# EasyEDA Pro project DOUBLE_CAMERA_SCARY.eprj, board Adafruit OV5640 Breakout
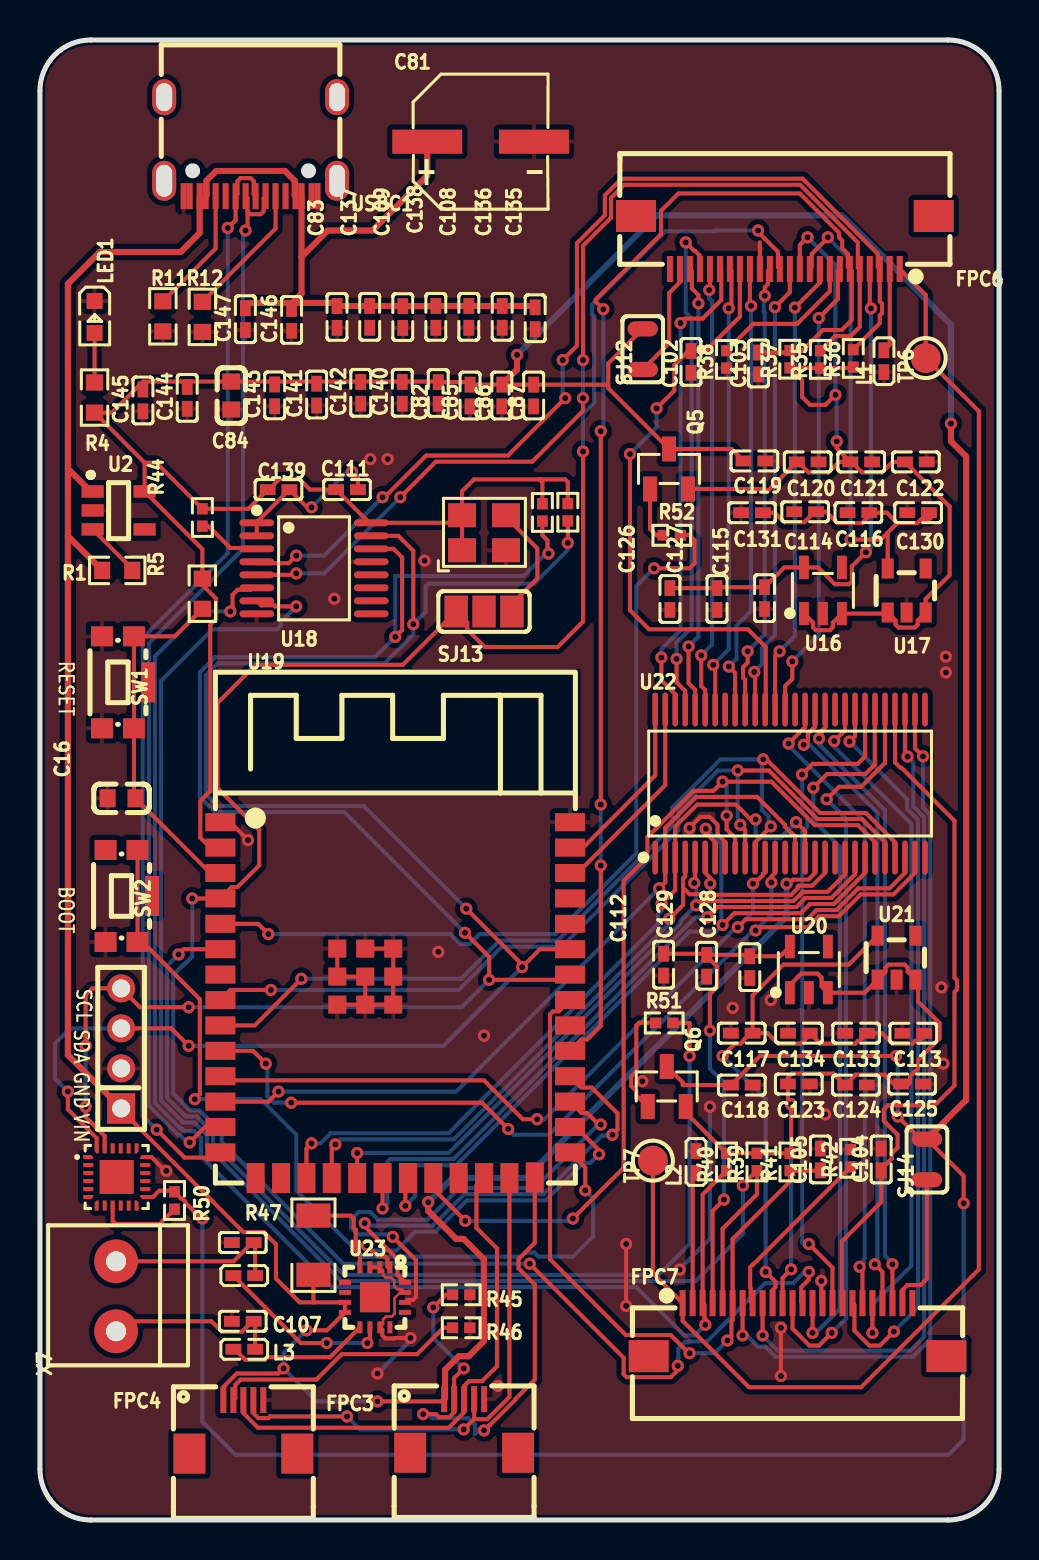
[diagram p1: board, top side]
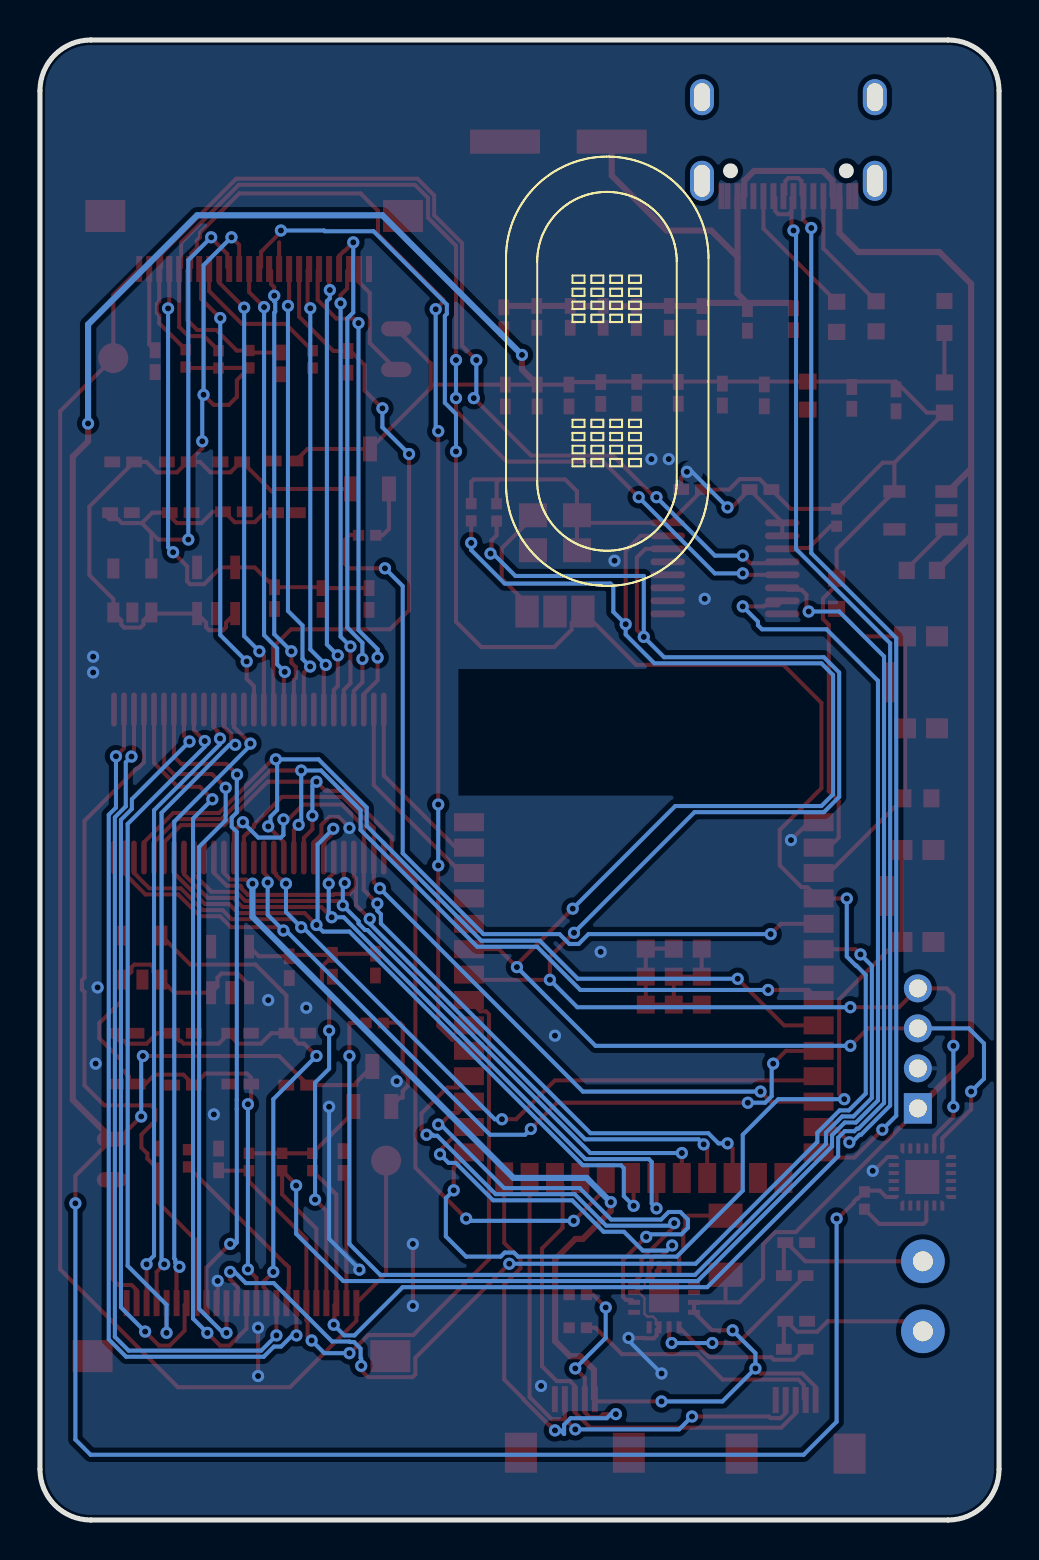
[diagram p2: board, bottom side, seen from below]

Outline 48 x 74 mm; copper layers: Top Layer, Bottom Layer. Coordinates in mm from the lower left corner of the outline.
Outline path: 0,71.46 0,2.54 arc(0.74,0.74) 2.54,0 45.46,0 arc(47.26,0.74) 48,2.54 48,71.46 arc(47.26,73.26) 45.46,74 2.54,74 arc(0.74,73.26) 0,71.46
Stack: Top Layer 0.035mm / Dielectric1 1.51mm FR4 er 4.5 / Bottom Layer 0.035mm

## Design rules (mm)
template: Custom Config
spacing copperThickness1oz (default): track to track 0.102, other pairs 0.152 to 0.3
spacing copperThickness2oz: track to track 0.203, other pairs 0.152 to 0.3
track width copperThickness1oz (default): min 0.127, default 0.254, max 2.54
track width copperThickness2oz: min 0.203, default 0.254, max 2.54
differential pair differentialPair (default): width min 0.127, default 0.254, max 2.54; gap min 0.152, default 0.152
via viaSize (default): diameter min 0.5, default 0.61, max 10; hole min 0.3, default 0.305, max 6.3

## Placement (name value [footprint] x y rotation side)
C16  1uF  [C0603]  4.08 36.08 180 top
C81  220uF  [CAP-SMD_BD6.3-L6.6-W6.6-LS7.2-FD]  22.05 68.92 0 top
C82  100nF  [C0402]  19.93 56.35 270 top
C83  100nF  [C0402]  14.87 60.15 270 top
C84  1uF  [C0603]  9.58 56.22 270 top
C85  100nF  [C0402]  21.52 56.22 270 top
C86  100nF  [C0402]  23.12 56.22 270 top
C87  100nF  [C0402]  24.71 56.22 270 top
C102  22pF  [C0402]  32.58 57.91 90 top
C103  100nF  [C0402]  35.96 57.83 270 top
C104  22pF  [C0402]  42.1 18.03 270 top
C105  100nF  [C0402]  39.06 18.03 90 top
C106  22pF  [C0402]  10.15 13.87 0 top
C107  22pF  [C0402]  10.15 9.94 0 top
C108  100nF  [C0402]  21.46 60.16 90 top
C109  10uF  [C0402]  18.16 60.15 90 top
C111  100nF  [C0402]  15.37 51.52 0 top
C112  100nF  [C0402]  31.21 27.77 90 top
C113  100nF  [C0402]  43.71 24.34 0 top
C114  100nF  [C0402]  38.3 50.41 0 top
C115  100nF  [C0402]  36.26 46.09 90 top
C116  100nF  [C0402]  40.96 50.37 0 top
C117  100nF  [C0402]  35.12 24.34 0 top
C118  100nF  [C0402]  35.12 21.75 180 top
C119  100nF  [C0402]  35.76 52.95 180 top
C120  10uF  [C0402]  38.42 52.91 180 top
C121  10uF  [C0402]  41.1 52.91 180 top
C122  10uF  [C0402]  43.84 52.91 180 top
C123  10uF  [C0402]  37.98 21.8 0 top
C124  10uF  [C0402]  40.84 21.75 180 top
C125  10uF  [C0402]  43.65 21.8 180 top
C126  10uF  [C0402]  31.53 46.05 90 top
C127  10uF  [C0402]  33.88 46.05 90 top
C128  10uF  [C0402]  35.52 27.64 90 top
C129  10uF  [C0402]  33.37 27.71 90 top
C130  10uF  [C0402]  43.95 50.37 0 top
C131  10uF  [C0402]  35.64 50.37 0 top
C133  10uF  [C0402]  40.85 24.34 0 top
C134  10uF  [C0402]  37.98 24.34 0 top
C135  100nF  [C0402]  24.78 60.09 270 top
C136  10uF  [C0402]  23.13 60.16 270 top
C137  10uF  [C0402]  16.5 60.16 270 top
C138  100nF  [C0402]  19.81 60.16 270 top
C139  100nF  [C0402]  11.94 51.52 0 top
C140  10uF  [C0402]  18.13 56.36 90 top
C141  10uF  [C0402]  13.85 56.27 90 top
C142  10uF  [C0402]  16.05 56.36 90 top
C143  10uF  [C0402]  11.75 56.23 90 top
C144  10uF  [C0402]  7.37 56.11 90 top
C145  10uF  [C0402]  5.15 55.98 90 top
C146  10uF  [C0402]  12.59 60 90 top
C147  10uF  [C0402]  10.28 60.04 90 top
FPC3  AFC01-S05FCA-00  [FPC-SMD_AFC01-S05FCA-00]  21.23 4.7 0 top
FPC4  AFC01-S05FCA-00  [FPC-SMD_AFC01-S05FCA-00]  10.18 4.66 0 top
FPC6  AFC01-S24FCA-00  [FPC-SMD_24P-P0.50_AFC01-S24FCA-00]  37.28 63.87 180 top
FPC7  AFC01-S24FCA-00  [FPC-SMD_24P-P0.50_AFC01-S24FCA-00]  37.92 9.52 0 top
JP1  HX PZ2.0-1x4P ZZ  [HDR-TH_4P-P2.00-V-M-3]  4.06 23.58 90 top
L1  BLM15AG102SN1D  [L0402]  42.24 57.94 90 top
L2  BLM15AG102SN1D  [L0402]  32.83 17.9 270 top
L3  BLM15AG102SN1D  [L0402]  10.22 8.53 0 top
L4  BLM15AG102SN1D  [L0402]  10.22 12.22 0 top
LED1  KT-0603G  [LED0603-RD]  2.73 60.15 270 top
Q5  HL3401A  [SOT-23-3_L2.9-W1.3-P1.90-LS2.4-BR]  31.48 52.55 270 top
Q6  HL3401A  [SOT-23-3_L2.9-W1.3-P1.90-LS2.4-BR]  31.37 21.68 270 top
R1  100kΩ  [R0603]  3.87 47.48 0 top
R4  10kΩ  [R0603]  2.73 56.12 270 top
R5  10kΩ  [R0603]  8.13 46.31 90 top
R11  5.1kΩ  [R0603]  6.15 60.18 90 top
R12  5.1kΩ  [R0603]  8.13 60.16 270 top
R35  10kΩ  [R0402]  39.06 58.03 90 top
R36  10kΩ  [R0402]  40.7 58.08 90 top
R37  10kΩ  [R0402]  37.53 58.04 90 top
R38  10kΩ  [R0402]  34.36 58.03 90 top
R39  10kΩ  [R0402]  35.88 17.9 270 top
R40  10kΩ  [R0402]  34.36 17.9 270 top
R41  10kΩ  [R0402]  37.53 17.9 270 top
R42  10kΩ  [R0402]  40.58 18.09 270 top
R44  10kΩ  [R0402]  8.13 50.12 270 top
R45  10kΩ  [R0402]  21.08 11.26 0 top
R46  10kΩ  [R0402]  21.08 9.61 0 top
R47  1mΩ  [R1206]  13.69 13.74 270 top
R48  47kΩ  [R0402]  26.42 50.39 90 top
R49  47kΩ  [R0402]  25.15 50.38 90 top
R50  47kΩ  [R0402]  6.73 15.97 90 top
R51  1kΩ  [R0402]  31.24 24.85 0 top
R52  1kΩ  [R0402]  31.62 49.24 0 top
SJ12  SOLDERJUMPER  [SOLDERJUMPER_ARROW_NOPASTE]  30.17 58.54 90 top
SJ13  SOLDERJUMPER_2WAY  [SOLDERJUMPER_2WAY_OPEN_NOPASTE]  22.23 45.43 0 top
SJ14  SOLDERJUMPER  [SOLDERJUMPER_ARROW_NOPASTE]  44.39 18.03 90 top
SW1  KMR221GLFS  [KEY-SMD_KMR2XXGXXX]  4.27 41.88 270 top
SW2  KMR221GLFS  [KEY-SMD_KMR2XXGXXX]  4.44 31.2 270 top
TP6  TESTPOINTROUND1.5MM  [TESTPOINT_ROUND_1.5MM]  44.33 58.1 0 top
TP7  TESTPOINTROUND1.5MM  [TESTPOINT_ROUND_1.5MM]  30.68 17.97 0 top
U2  AP2112K-3.3TRG1  [SOT-25-5_L2.9-W1.6-P0.95-LS2.8-BL]  3.94 50.48 270 top
U16  TLV74328PDBVR  [SOT-23-5_L3.0-W1.7-P0.95-LS2.8-BL]  39.18 46.48 0 top
U17  TLV74315PDBVR  [SOT-23-5_L2.9-W1.6-P0.95-LS2.8-BL]  43.38 46.48 0 top
U18  PCA9546APWR  [TSSOP-16_L5.0-W4.4-P0.65-LS6.4-BL]  13.72 47.58 270 top
U19  ESP32-S3-WROOM-1-N16R8  [WIRELM-SMD_ESP32-S3-WROOM-1]  17.78 25.99 0 top
U20  TLV74328PDBVR  [SOT-23-5_L3.0-W1.7-P0.95-LS2.8-BL]  38.48 27.52 0 top
U21  TLV74315PDBVR  [SOT-23-5_L2.9-W1.6-P0.95-LS2.8-BL]  42.87 28.12 0 top
U22  SN74CBT16211CDGGR  [TSSOP-56_L14.0-W6.1-P0.50-LS8.1-BL]  37.54 36.82 0 top
U23  MAX98357AETE+T  [TQFN-16_L3.0-W3.0-P0.50-BL-EP1.5]  16.76 11.14 180 top
U24  ICM-20948  [QFN-24_L3.0-W3.0-P0.40-BL-EP]  3.84 17.15 270 top
USBC1  TYPE-C-31-M-12  [USB-C_SMD-TYPE-C-31-M-12]  10.54 68.67 180 top
X7  TERMBLOCK_1X2  [TERMBLOCK_1X2-3.5MM]  3.81 11.14 90 top
X9  24MHz  [OSC-SMD_4P-L3.2-W2.5-BL]  22.23 49.36 0 top

## Footprints (pads in the part's own frame, mm; a bottom-side part is the same pattern mirrored in y, then rotated)
C0402
  rect 0.79x0.54 smd: 1(-0.545,0) 2(0.545,0)
C0603
  rect 0.8x0.9 smd: 1(-0.7,0) 2(0.7,0)
CAP-SMD_BD6.3-L6.6-W6.6-LS7.2-FD
  rect 3.5x1.2 smd: 1(-2.67,0) 2(2.67,0)
FPC-SMD_24P-P0.50_AFC01-S24FCA-00
  rect 0.3x1.3 smd: 1(-5.75,1.325) 2(-5.25,1.325) 3(-4.75,1.325) 4(-4.25,1.325) 5(-3.75,1.325) 6(-3.25,1.325) 7(-2.75,1.325) 8(-2.25,1.325) 9(-1.75,1.325) 10(-1.25,1.325) 11(-0.75,1.325) 12(-0.25,1.325) 13(0.25,1.325) 14(0.75,1.325) 15(1.25,1.325) 16(1.75,1.325) 17(2.25,1.325) 18(2.75,1.325) 19(3.25,1.325) 20(3.75,1.325) 21(4.25,1.325) 22(4.75,1.325) 23(5.25,1.325) 24(5.75,1.325)
  rect 2x1.6 smd: 25(7.449,-1.325) 26(-7.45,-1.325)
FPC-SMD_AFC01-S05FCA-00
  rect 0.3x1.3 smd: 1(-1,1.34) 2(-0.5,1.34) 3(0,1.34) 4(0.5,1.34) 5(1,1.34)
  rect 1.6x2 smd: 6(2.7,-1.34) 7(-2.7,-1.34)
HDR-TH_4P-P2.00-V-M-3
  rect 1.524x1.4 hole 0.9: 1(-3,0)
  round 1.4 hole 0.9: 2(-1,0) 3(1,0) 4(3,0)
KEY-SMD_KMR2XXGXXX
  rect 1x1.1 smd: 1(-2.3,0.438) 2(2.3,0.438) 3(-2.3,-1.162) 4(2.3,-1.162)
  rect 2x0.7 smd: 5(0,1.162)
L0402
  rect 0.79x0.54 smd: 1(-0.545,0) 2(0.545,0)
LED0603-RD
  rect 0.8x0.8 smd: 1(-0.799,0) 2(0.799,0)
OSC-SMD_4P-L3.2-W2.5-BL
  rect 1.4x1.2 smd: 1(-1.1,-0.875) 2(1.1,-0.875) 3(1.1,0.875) 4(-1.1,0.875)
QFN-24_L3.0-W3.0-P0.40-BL-EP
  custom 0.2x0.506 smd: 1(-1,-1.427) 6(1,-1.427) 13(1,1.427) 18(-1,1.427)
  rect 0.2x0.505 smd: 2(-0.6,-1.427) 3(-0.2,-1.427) 4(0.2,-1.427) 5(0.6,-1.427) 14(0.6,1.427) 15(0.2,1.427) 16(-0.2,1.427) 17(-0.6,1.427)
  custom 0.506x0.2 smd: 7(1.427,-1) 12(1.427,1) 19(-1.427,1) 24(-1.427,-1)
  rect 0.505x0.2 smd: 8(1.427,-0.6) 9(1.427,-0.2) 10(1.427,0.2) 11(1.427,0.6) 20(-1.427,0.6) 21(-1.427,0.2) 22(-1.427,-0.2) 23(-1.427,-0.6)
  rect 1.7x1.7 smd: 25(0,0)
R0402
  rect 0.566x0.54 smd: 1(-0.433,0) 2(0.433,0)
R0603
  rect 0.806x0.864 smd: 1(-0.753,0) 2(0.753,0)
R1206
  rect 1.208x1.701 smd: 1(-1.479,0) 2(1.479,0)
SOLDERJUMPER_2WAY_OPEN_NOPASTE
  rect 1.169x1.6 smd: 1(-1.397,0) 2(0,0) 3(1.397,0)
SOLDERJUMPER_ARROW_NOPASTE
  rrect 0.762x1.524 smd: 1(-1.016,0) 2(1.016,0)
SOT-23-3_L2.9-W1.3-P1.90-LS2.4-BR
  rect 1.25x0.7 smd: 1(1,-0.95) 2(1,0.95) 3(-1,0)
SOT-23-5_L2.9-W1.6-P0.95-LS2.8-BL
  rect 0.6x1 smd: 1(-0.95,-1.1) 2(0,-1.1) 3(0.95,-1.1) 4(0.95,1.1) 5(-0.95,1.1)
SOT-23-5_L3.0-W1.7-P0.95-LS2.8-BL
  rect 0.49x1.157 smd: 1(-0.95,-1.153) 2(0,-1.153) 3(0.95,-1.153)
  rect 0.49x1.175 smd: 4(0.95,1.153) 5(-0.95,1.153)
SOT-25-5_L2.9-W1.6-P0.95-LS2.8-BL
  rect 0.623x1.105 smd: 1(-0.95,-1.3) 2(-0.001,-1.3) 3(0.95,-1.3) 4(0.95,1.3) 5(-0.95,1.3)
TERMBLOCK_1X2-3.5MM
  round 2.184 hole 1: 1(1.8,0) 2(-1.7,0)
TESTPOINT_ROUND_1.5MM
  round 1.5 smd: P$1(0,0)
TQFN-16_L3.0-W3.0-P0.50-BL-EP1.5
  rect 0.25x0.6 smd: 1(-0.749,-1.5) 2(-0.248,-1.5) 3(0.252,-1.5) 4(0.751,-1.5) 9(0.75,1.5) 10(0.25,1.5) 11(-0.25,1.5) 12(-0.749,1.5)
  rect 0.6x0.25 smd: 5(1.5,-0.748) 6(1.5,-0.248) 7(1.5,0.252) 8(1.5,0.752) 13(-1.5,0.752) 14(-1.5,0.252) 15(-1.5,-0.248) 16(-1.5,-0.748)
  rect 1.5x1.5 smd: 17(0,0)
TSSOP-16_L5.0-W4.4-P0.65-LS6.4-BL
  oval 0.343x1.732 smd: 1(-2.275,-2.866) 2(-1.625,-2.866) 3(-0.975,-2.866) 4(-0.325,-2.866) 5(0.325,-2.866) 6(0.975,-2.866) 7(1.625,-2.866) 8(2.275,-2.866) 9(2.275,2.866) 10(1.625,2.866) 11(0.975,2.866) 12(0.325,2.866) 13(-0.325,2.866) 14(-0.975,2.866) 15(-1.625,2.866) 16(-2.275,2.866)
TSSOP-56_L14.0-W6.1-P0.50-LS8.1-BL
  oval 0.28x1.7 smd: 1(-6.75,-3.7) 2(-6.25,-3.7) 3(-5.75,-3.7) 4(-5.25,-3.7) 5(-4.75,-3.7) 6(-4.25,-3.7) 7(-3.75,-3.7) 8(-3.25,-3.7) 9(-2.75,-3.7) 10(-2.25,-3.7) 11(-1.75,-3.7) 12(-1.25,-3.7) 13(-0.75,-3.7) 14(-0.25,-3.7) 15(0.25,-3.7) 16(0.75,-3.7) 17(1.25,-3.7) 18(1.75,-3.7) 19(2.25,-3.7) 20(2.75,-3.7) 21(3.25,-3.7) 22(3.75,-3.7) 23(4.25,-3.7) 24(4.75,-3.7) 25(5.25,-3.7) 26(5.75,-3.7) 27(6.25,-3.7) 28(6.75,-3.7) 29(6.75,3.7) 30(6.25,3.7) 31(5.75,3.7) 32(5.25,3.7) 33(4.75,3.7) 34(4.25,3.7) 35(3.75,3.7) 36(3.25,3.7) 37(2.75,3.7) 38(2.25,3.7) 39(1.75,3.7) 40(1.25,3.7) 41(0.75,3.7) 42(0.25,3.7) 43(-0.25,3.7) 44(-0.75,3.7) 45(-1.25,3.7) 46(-1.75,3.7) 47(-2.25,3.7) 48(-2.75,3.7) 49(-3.25,3.7) 50(-3.75,3.7) 51(-4.25,3.7) 52(-4.75,3.7) 53(-5.25,3.7) 54(-5.75,3.7) 55(-6.25,3.7) 56(-6.75,3.7)
USB-C_SMD-TYPE-C-31-M-12
  oval 1.2x2 hole 0.8x1.6: 0(-4.325,1.706) 1(4.325,1.706)
  oval 1.2x1.8 hole 0.8x1.4: 2(4.325,-2.474) 3(-4.325,-2.474)
  rect 0.3x1.3 smd: A1(-3.35,2.474) A4(-2.55,2.474) A5(-1.25,2.474) A6(-0.25,2.474) A7(0.25,2.474) A8(1.25,2.474) A9(2.55,2.474) A12(3.35,2.474) B1(3.05,2.474) B4(2.25,2.474) B5(1.75,2.474) B6(0.75,2.474) B7(-0.75,2.474) B8(-1.75,2.474) B9(-2.25,2.474) B12(-3.05,2.474)
WIRELM-SMD_ESP32-S3-WROOM-1
  rect 1.5x0.9 smd: 1(-8.75,8.895) 2(-8.75,7.625) 3(-8.75,6.355) 4(-8.75,5.085) 5(-8.75,3.815) 6(-8.75,2.545) 7(-8.75,1.275) 8(-8.75,0.005) 9(-8.75,-1.265) 10(-8.75,-2.535) 11(-8.75,-3.805) 12(-8.75,-5.075) 13(-8.75,-6.345) 14(-8.75,-7.615) 27(8.75,-7.615) 28(8.75,-6.345) 29(8.75,-5.075) 30(8.75,-3.805) 31(8.75,-2.535) 32(8.75,-1.265) 33(8.75,0.005) 34(8.75,1.275) 35(8.75,2.545) 36(8.75,3.815) 37(8.75,5.085) 38(8.75,6.355) 39(8.75,7.625) 40(8.75,8.895)
  rect 0.9x1.5 smd: 15(-6.985,-8.895) 16(-5.715,-8.895) 17(-4.445,-8.895) 18(-3.175,-8.895) 19(-1.905,-8.895) 20(-0.635,-8.895) 21(0.635,-8.895) 22(1.905,-8.895) 23(3.175,-8.895) 24(4.445,-8.895) 25(5.715,-8.895) 26(6.985,-8.865)
  rect 0.9x0.9 smd: 41(-2.9,2.575) 41(-2.9,1.175) 41(-2.9,-0.225) 41(-1.5,2.575) 41(-1.5,1.175) 41(-1.5,-0.225) 41(-0.1,2.575) 41(-0.1,1.175) 41(-0.1,-0.225)

## Nets
As in the schematic, except:
GND: C16.2 C81.2 C82.2 C83.2 C84.2 C85.2 C86.2 C87.2 C102.1 C103.2 C104.1 C105.2 C106.1 C107.1 C108.1 C109.1 C112.1 C113.1 C114.1 C115.1 C116.1 C117.1 C118.1 C119.1 C120.1 C121.1 C122.1 C123.2 C124.1 C125.1 C126.1 C127.1 C128.1 C129.1 C130.1 C131.1 C133.1 C134.1 C135.2 C136.2 C138.2 C140.1 C141.1 C142.1 C143.1 C144.1 C145.1 C146.1 C147.1 FPC3.5 FPC4.5 FPC6.15 FPC7.15 JP1.2 L1.1 L2.1 LED1.1 R11.1 R12.2 R38.1 R42.1 R45.2 R46.2 SW1.3 SW1.4 SW2.4 U2.2 U16.2 U17.2 U18.8 U18.13 U19.1 U19.40 U19.41 U20.2 U21.2 U22.8 U23.2 U23.3 U23.11 U23.15 U24.18 USBC1.A1 USBC1.A12 USBC1.B1 USBC1.B12 X9.2
$2N4099: C111.2 C139.2 U18.1 U18.2

Pads without a net: C137 2; FPC3 6 7; FPC4 6 7; FPC6 25 26; FPC7 25 26; SJ13 2; SW1 5; SW2 3 5; U2 4; U16 4; U17 4; U18 9 10 11 12; U19 7 15 16 23 32 36 37; U20 4; U21 4; U22 1 14 28 29 38 42 49; U23 5 6 12 13 17; U24 1 2 3 4 5 6 7 8 10 11 12 14 15 16 17 19 20 21 22 25; USBC1 0 1 2 3 A8 B8

## Via types
v1: diameter 0.61, hole 0.305, Top Layer to Bottom Layer, 191 vias

## Routing (per net, layer and track width the routed paths; a pad name or vN(x,y) marks a point on that pad's centre or on a via; arc(x,y) is an arc through that point)
1.5V: length 34.9
  Top Layer w0.203: v1(34.16,23.2) 34.78,23.82 35.08,23.82 35.23,23.97 35.23,24.01 35.56,24.34 C117.2 ; C117.2 35.67,26.23 35.89,26.45 35.9,26.45 36.05,26.6 36.05,26.61 37.21,27.77 40.48,27.77 U21.5 ; C117.2 36.42,24.34 36.94,23.82 38.08,23.82 38.53,24.26 C134.2 39.05,23.82 40.8,23.82 40.95,23.96 41.02,23.96 41.39,24.33 C133.2 42.14,24.34 42.67,23.81 43.66,23.81 43.81,23.96 ; C113.2 44.25,24.2 44.02,23.96 43.81,23.96 ; FPC7.10 36.66,11.5 36.81,11.65 36.81,11.92 v1(36.32,12.41)
  Bottom Layer w0.203: v1(34.16,23.2) 36.32,21.04 v1(36.32,12.41)
1.5V_X: length 32
  Top Layer w0.203: C130.2 44.51,50.37 44.61,50.27 44.61,50.13 44.51,50.04 44.1,50.04 43.9,49.84 42.9,49.84 ; v1(40.57,49.02) 42.08,49.02 42.43,49.37 ; 42.9,49.84 42.43,49.37 ; 42.9,49.84 42.38,50.37 C116.2 41.5,50.21 41.14,49.84 39.91,49.84 39.35,50.41 C114.2 38.79,50.37 38.73,50.37 38.25,49.89 37.25,49.89 36.77,50.37 C131.2 ; 42.43,49.37 U17.5 ; v1(39.43,64.14) 39.43,64.11 38.63,63.3 38.63,62.65 FPC6.10
  Bottom Layer w0.203: v1(39.43,64.14) 40.57,62.99 v1(40.57,49.02)
2.8V: length 24.9
  Top Layer w0.203: C129.2 33.31,28.31 C112.2 ; C129.2 33.4,28.22 33.4,28.16 33.89,27.67 33.89,26.67 33.53,26.31 v1(33.53,24.47) ; C129.2 35.46,28.26 C128.2 37.05,28.19 U20.5 ; v1(34.23,16.02) 33.67,15.45 FPC7.4
  Bottom Layer w0.203: v1(33.53,24.47) 33.53,22.57 34.23,21.86 v1(34.23,16.02)
2.8V_X: length 26
  Top Layer w0.203: v1(41.34,48.39) 40.63,47.68 40.63,46.94 40.48,46.79 39.78,46.79 38.94,47.63 U16.5 37.25,47.63 C115.2 33.93,46.64 C127.2 C126.2 ; v1(41.59,60.58) 41.53,60.64 FPC6.4
  Bottom Layer w0.203: v1(41.34,48.39) 41.59,48.64 v1(41.59,60.58)
3.3V: length 12.9
  Top Layer w0.203: FPC4.2 9.78,6.09 9.78,6.75 10.04,7.02 13.83,7.02 15.1,8.29 18.87,8.29 20.19,9.61 R46.1
3V3: length 249.8
  Top Layer w0.203: SJ12.2 28.44,57.83 28.44,56.68 ; v1(42.85,23.2) 36.03,23.2 C118.2 32.17,21.75 32.17,21.87 Q6.3 ; 28.44,56.68 28.44,56.59 Q5.3 34.61,53.55 C119.2 ; 28.44,56.68 28.36,56.77 C87.1 C86.1 C85.1 21.4,56.9 C82.1 19.9,56.92 C84.1 5.16,56.92 3.61,55.37 R4.2 5.24,52.87 ; 5.24,52.87 5.24,51.43 8.13,48.54 R5.2 8.13,46.75 8.81,46.07 8.81,45.05 8.52,44.76 8.52,36.45 8.03,35.95 8.03,34.11 8.52,33.62 U19.2 ; 5.24,52.87 5.82,52.87 R44.1 10.43,50.56 C139.1 11.46,51.52 11.98,52.04 12.98,52.04 13.51,51.52 C111.1 16.48,49.86 U18.16 20.75,49.86 X9.4 ; R49.2 25.15,51.89 25,52.03 ; U24.13 5.65,16.15 5.97,16.47 6.67,16.47 R50.2 7.06,16.08 7.11,16.08 7.26,15.93 7.26,15.88 8.07,15.07 v1(8.13,15.07) ; 25,52.03 21.72,52.03 21.12,51.44 X9.4 ; 25,52.03 26.29,52.03 26.42,51.9 26.42,50.82 R48.2 ; X9.4 X9.1 ; v1(42.93,20.17) 44.06,19.04 SJ14.2 46.23,17.21 v1(46.23,15.83)
  Top Layer w0.305: C86.1 23.88,57.53 v1(23.88,58.25) ; v1(45.59,54.82) 45.59,53.93 46.36,53.17 46.36,21.01 SJ14.2
  Bottom Layer w0.203: v1(42.85,23.2) 42.93,23.12 v1(42.93,20.17) ; v1(8.13,15.07) 8.13,4.91 9.78,3.26 45.47,3.26 46.23,4.02 v1(46.23,15.83)
  Bottom Layer w0.305: v1(45.59,54.82) 45.59,59.78 40.13,65.24 30.86,65.24 v1(23.88,58.25)
AGND: length 6.6
  Top Layer w0.203: FPC7.2 32.67,17.19 L2.2
AGND_X: length 4.2
  Top Layer w0.203: L1.2 42.53,58.78 FPC6.2
GND: length 44.3
  Top Layer w0.127: U23.2 17.17,12.48 17.17,12.25 17.3,12.12 17.58,12.12 17.73,11.97 17.73,11.69 17.87,11.54 18.1,11.54 U23.15 18.03,11.38 17.75,11.1 17.75,10.31 17.6,10.17 17.32,10.17 17.17,10.02 17.17,9.79 U23.11
  Top Layer w0.203: U19.41 U19.41 U19.41 U19.41 U19.41 ; U19.1 9.52,34.89 v1(10.41,34) ; FPC7.15 39.11,10.9 v1(39.11,11.95) ; v1(29.34,13.8) v1(29.34,10.7) ; v1(18.54,9.1) 17.76,9.1 17.74,9.08 17.28,9.08 17.13,9.23 17.13,9.52 U23.11 ; U22.8 34.29,33.89 33.91,34.27 33.91,34.76 33.52,35.15 33.05,35.15 32.53,34.63 32.51,34.63 ; U23.3 U23.2 ; 36.03,62.55 36.03,63.88 ; U19.41 U19.41 ; U19.41 U19.41 U19.41 U19.41 ; v1(6.32,17.46) 6.27,17.46 5.58,18.15 U24.18 ; v1(37.08,7.2) v1(37.08,9.61)
  Bottom Layer w0.203: v1(18.54,9.1) 18.54,8.98 v1(16.89,7.33) ; v1(33.53,20.66) 33.53,14.06 32,12.53 ; 6.22,17.49 6.25,17.46 v1(6.32,17.46)
  vias: v1(14.73,46.06) v1(16.53,53.05) v1(17.4,53.05) v1(19.24,47.97) v1(19.94,28.41) v1(22.23,24.22) v1(22.92,6.7) v1(30.15,21.94) v1(32.02,12.52) v1(32.51,34.6) v1(34.67,25.61) v1(36.58,25.99) v1(39.3,20.28) v1(45.11,26.63) v1(45.21,22.82) v1(45.34,43.17) v1(45.34,42.38)
VCC: length 168
  Top Layer w0.203: 13.67,10.88 13.69,10.9 R47.2 ; 13.67,10.88 U23.7 U23.8 14.36,9.48 v1(13.33,9.48) ; 13.67,10.88 13,10.88 11.81,12.07 11.81,13.78 11.2,14.4 10.17,14.4 4.06,20.51 JP1.1 ; FPC3.1 20.11,5.93 v1(16.89,5.93) ; 38.79,33.12 38.79,32.36 38.46,32.02 37.69,32.02 37.49,31.82 v1(37.36,31.82) ; FPC4.1 9.18,6.66 9.85,7.33 11.94,7.33 v1(12.19,7.58)
  Top Layer w0.305: USBC1.A4 13.09,63.16 ; 13.09,63.16 13.09,61.32 12.62,60.85 ; 13.09,63.16 14.4,64.48 16.64,64.48 19.38,67.22 C81.1 ; 12.62,60.85 14.71,60.85 C83.1 16.5,60.7 C137.1 18.15,60.7 C109.2 19.8,60.69 C138.1 C108.2 C136.1 24.72,60.7 C135.1 ; 12.62,60.85 10.43,60.85 ; JP1.1 1.4,23.25 1.4,49.2 ; USBC1.A9 7.99,64.35 7.04,63.4 2.99,63.4 1.4,61.81 1.4,52.57 ; 1.4,49.2 R1.1 ; 1.4,49.2 1.4,52.57 ; 1.4,52.57 2.64,51.33 ; FPC3.1 20.27,6.09 20.27,7.51 20.96,8.19 21.46,8.19 22.22,8.94 22.22,13.04 21.2,14.06 20.83,14.06 19.43,15.45 v1(19.43,15.89) ; USBC1.B4 8.34,66.24 8.34,66.97 8.82,67.45 12.26,67.45 12.75,66.97 12.75,66.24 USBC1.B9
  Bottom Layer w0.203: v1(16.89,5.93) 13.84,5.93 v1(12.19,7.58) 12.19,8.34 v1(13.33,9.48)
  Bottom Layer w0.305: v1(37.36,31.82) 37.36,30.16 24.3,17.1 20.64,17.1 v1(19.43,15.89)
VINA: length 50.1
  Top Layer w0.203: C121.2 39.88,53.58 v1(39.88,53.93) ; C121.2 39.99,52.91 39.47,52.38 38.47,52.38 37.95,52.91 C120.2 36.4,51.43 36.27,51.55 Q5.2 ; C121.2 40.62,52.91 41.15,52.38 42.15,52.38 42.67,52.91 43.29,52.91 45.53,50.67 45.53,47.24 44.33,46.04 U17.3 43.93,44.98 43.93,44.77 43.78,44.62 42.97,44.62 42.82,44.77 42.82,44.98 U17.1 42.37,45.32 U16.3 39.68,44.87 39.68,44.64 39.53,44.49 38.83,44.49 38.69,44.64 38.69,44.87 U16.1 ; 38.03,62.55 38.03,63.75 v1(38.42,64.14) ; R36.1 40.66,57.6 R35.1 39.05,57.61 R37.1 38.14,56.99 38.14,56.15 38.54,55.75 39.3,55.75 v1(39.81,56.26)
  Bottom Layer w0.203: v1(38.42,64.14) 39.81,62.74 v1(39.81,56.26) 39.88,56.2 v1(39.88,53.93)
VINB: length 42.3
  Top Layer w0.203: U20.1 37.53,26.75 37.93,27.14 37.93,27.15 38.1,27.32 38.91,27.32 39.12,27.12 39.12,26.68 U20.3 41.27,26.36 U21.1 42.32,27.41 42.32,27.62 42.47,27.77 43.28,27.77 43.43,27.62 43.43,27.41 U21.3 43.95,26.89 43.95,25.92 45.03,24.84 45.03,24.09 43.95,23.01 43.95,22.58 43.54,22.17 43.54,21.86 43.48,21.8 C125.2 42.74,21.8 42.27,22.27 40.82,22.27 C124.2 39.72,22.32 37.64,22.32 37.43,22.11 C123.1 37.43,20.95 v1(37.59,20.79) 37.59,18.39 R41.1 R39.1 R40.1 32.19,20.5 32.32,20.63 Q6.2 ; FPC7.11 37.17,12.11 v1(37.59,12.53)
  Bottom Layer w0.203: v1(37.59,12.53) v1(37.59,20.79)
BCLK: length 22.4
  Top Layer w0.203: U19.30 27.1,21.62 27.61,21.62 28.9,20.33 28.9,19.52 v1(28.65,19.26) ; U23.16 17.89,12.26 17.89,13.04 16.26,14.67 v1(16.26,14.84)
  Bottom Layer w0.203: v1(16.26,14.84) 16.38,14.72 19.66,14.72 21.24,16.29 25.19,16.29 28.12,19.21 28.3,19.21 28.35,19.26 v1(28.65,19.26)
BOOT: length 44.1
  Top Layer w0.203: v1(27.29,16.48) 27.29,17.62 U19.27 ; v1(7.75,21.04) 8,21.3 8,26.04 5.14,28.9 SW2.2 SW2.1
  Bottom Layer w0.203: v1(7.75,21.04) 11.05,21.04 12.83,19.26 12.83,16.47 16.13,13.17 24.08,13.17 24.28,13.37 24.74,13.37 24.95,13.17 26.67,13.17 27.69,14.18 27.69,16.09 v1(27.29,16.48)
D2: length 38.6
  Top Layer w0.203: v1(11.94,21.42) 11.43,20.92 U19.12 ; v1(30.99,31.58) 31.29,31.89 U22.2 31.29,34.61 32.84,36.15 35.89,36.15 37.29,34.76 37.29,34.66 37.61,34.33 37.64,34.33 37.79,34.17 37.79,33.12
  Bottom Layer w0.203: v1(11.94,21.42) 20.83,21.42 v1(30.99,31.58)
D3: length 38.9
  Top Layer w0.203: U19.17 13.33,18.58 v1(13.59,18.83) ; v1(31.11,30.82) 31.79,31.5 31.79,34.67 32.89,35.77 34.83,35.77 35.57,35.03 v1(35.81,35.03) ; U22.16 38.29,34.44 v1(37.84,34.89)
  Bottom Layer w0.203: v1(13.59,18.83) 14.04,18.83 14.55,19.34 20.45,19.34 30.94,29.83 30.94,30.29 31.11,30.47 v1(31.11,30.82) ; v1(35.81,35.03) 35.81,34.25 35.94,34.12 37.08,34.12 v1(37.84,34.89)
D4: length 35.2
  Top Layer w0.203: 32.19,31.62 32.19,32.08 32.29,32.19 U22.4 ; 32.19,31.62 32.51,31.29 33.28,31.29 33.32,31.26 37.6,31.26 37.92,31.59 37.92,31.67 37.97,31.71 38.65,31.71 39.29,32.36 U22.18 ; 32.19,31.62 32.19,30.75 v1(31.5,30.06) ; v1(14.78,18.78) 14.61,18.6 U19.18
  Bottom Layer w0.203: v1(14.78,18.78) 15.04,19.04 20.71,19.04 31.5,29.82 v1(31.5,30.06)
D5: length 34.8
  Top Layer w0.203: 32.79,33.12 32.79,31.9 v1(32.75,31.85) ; v1(15.87,18.35) U19.19 ; v1(32.84,30.73) 33.06,30.95 37.72,30.95 38.18,31.41 39.42,31.41 40.29,32.29 U22.20
  Bottom Layer w0.203: v1(15.87,18.35) 20.46,18.35 31.61,29.5 31.73,29.5 32.05,29.83 32.05,29.94 v1(32.84,30.73) 32.84,31.67 32.75,31.77 v1(32.75,31.85)
D6: length 37.3
  Top Layer w0.203: v1(33.4,30.14) 33.91,30.65 37.86,30.65 38.31,31.1 39.61,31.1 40.79,32.29 40.79,33.12 ; v1(17.14,15.58) U19.20 ; v1(33.55,31.82) 33.55,32.1 33.29,32.36 U22.6
  Bottom Layer w0.203: v1(33.55,31.82) 33.55,30.28 v1(33.4,30.14) 32.8,30.14 20.7,18.04 17.53,18.04 17.38,17.9 17.38,15.82 v1(17.14,15.58)
D7: length 39.7
  Top Layer w0.203: v1(18.29,15.71) 18.29,16.97 U19.21 ; U22.22 41.29,32.36 39.74,30.8 38.53,30.8 38.08,30.34 34.75,30.34 v1(34.16,29.75) ; 33.79,33.12 33.79,33.89 33.32,34.36 v1(33.32,34.56)
  Bottom Layer w0.203: v1(18.29,15.71) 18.78,16.2 18.78,17.6 18.92,17.74 20.83,17.74 32.51,29.42 33.83,29.42 v1(34.16,29.75) 34.11,29.81 34.11,33.78 v1(33.32,34.56)
D8: length 47.5
  Top Layer w0.203: v1(21.29,14.96) 19.68,16.56 U19.22 ; 34.79,33.12 34.79,34.1 34.37,34.53 v1(34.37,35.21) ; 41.79,33.12 41.79,33.89 40.94,34.74 38.78,34.74 36.61,36.92 v1(34.16,36.92) 33.71,36.46 32.72,36.46 30.4,34.14 30.4,33.15 29.21,31.96 29.21,17.61 v1(26.67,15.07)
  Bottom Layer w0.203: v1(34.37,35.21) 34.37,36.71 v1(34.16,36.92) ; v1(21.29,14.96) 26.56,14.96 v1(26.67,15.07)
D9: length 45.4
  Top Layer w0.203: U19.8 9.53,26.5 v1(11.56,26.5) ; v1(35.05,34.76) 35.29,34.52 U22.10 ; v1(34.92,37.47) 36.48,37.47 38.91,35.05 41.14,35.05 42.29,33.89 U22.24
  Bottom Layer w0.203: v1(11.56,26.5) 20.95,26.5 23.11,28.66 26.11,28.66 31.95,34.5 31.95,35.5 33.93,37.47 v1(34.92,37.47) 34.92,34.88 v1(35.05,34.76)
D+: length 55.3
  Top Layer w0.203: v1(9.4,64.6) 9.79,65 USBC1.B6 9.89,66.29 9.89,66.95 10.04,67.1 10.55,67.1 10.69,66.95 10.69,66.29 USBC1.A6 ; v1(5.84,19.52) 7.24,18.12 8.77,18.12 U19.14
  Bottom Layer w0.203: v1(9.4,64.6) 9.4,48.35 5.14,44.09 5.14,20.21 v1(5.84,19.52)
D-: length 53.9
  Top Layer w0.203: U19.13 8.26,19.65 v1(7.49,18.88) ; USBC1.B7 11.19,66.1 11.19,65.44 11.05,65.29 10.54,65.29 10.39,65.44 ; v1(10.29,64.48) 10.39,64.58 10.39,65.44 ; USBC1.A7 10.39,66.1 10.39,65.44
  Bottom Layer w0.203: v1(7.49,18.88) 7.37,18.88 6.98,19.26 6.91,19.26 5.45,20.72 5.45,43.84 10.16,48.55 10.16,64.22 10.29,64.35 v1(10.29,64.48)
DATA1: length 7.1
  Top Layer w0.203: SJ14.1 44.39,12.07 44.07,11.75 43.41,11.75 43.17,11.5 FPC7.23
DATA1_X: length 5.8
  Top Layer w0.203: 32.03,62.55 32.07,62.51 32.07,61.93 31.49,61.36 31.49,58.85 SJ12.1
DATA2: length 31.8
  Top Layer w0.203: 37.47,38.82 38.29,39.65 U22.41 ; FPC7.19 41.17,12.52 v1(41.02,12.66)
  Bottom Layer w0.203: v1(41.02,12.66) 41.22,12.86 41.22,13.02 41.28,13.07 41.28,34.92 37.47,38.73 v1(37.47,38.82)
DATA2_X: length 24.1
  Top Layer w0.203: v1(31.1,43.12) 31.1,41.98 31.79,41.29 31.79,40.52 ; 34.03,62.55 34.1,62.48 34.1,61 33.17,60.07 32.28,60.07 v1(32.06,59.85)
  Bottom Layer w0.203: v1(32.06,59.85) 32.06,44.49 31.1,43.54 v1(31.1,43.12)
DATA3: length 31.8
  Top Layer w0.203: v1(38.23,38.76) 38.43,38.96 38.43,39.31 38.79,39.67 38.79,40.52 ; v1(41.78,12.79) 42.17,12.4 FPC7.21
  Bottom Layer w0.203: v1(38.23,38.76) 38.52,38.76 41.91,35.36 41.91,12.92 v1(41.78,12.79)
DATA3_X: length 25.6
  Top Layer w0.203: v1(31.86,43.05) 31.86,41.88 32.29,41.45 U22.53 ; v1(32.32,63.88) 32.75,63.45 32.78,63.45 33.03,63.21 33.03,62.55
  Bottom Layer w0.203: v1(31.86,43.05) 31.86,43.87 32.62,44.62 32.62,60.08 32.32,60.38 v1(32.32,63.88)
DATA4: length 31.3
  Top Layer w0.203: v1(38.99,39.08) 39.12,39.2 39.12,39.45 39.31,39.65 39.31,40.5 U22.39 ; FPC7.22 v1(42.66,12.79)
  Bottom Layer w0.203: v1(42.66,12.79) 42.66,12.84 42.29,13.22 42.29,35.49 38.99,38.79 v1(38.99,39.08)
DATA4_X: length 22.5
  Top Layer w0.203: FPC6.22 32.63,62.45 32.63,61.57 32.95,61.25 v1(32.95,60.83) ; 32.79,40.52 32.79,41.5 32.46,41.84 v1(32.46,43.67)
  Bottom Layer w0.203: v1(32.95,60.83) 32.95,44.17 v1(32.46,43.67)
DATA5: length 35.3
  Top Layer w0.203: v1(39.75,38.95) 40.29,39.49 U22.37 ; FPC7.20 v1(41.66,9.36)
  Bottom Layer w0.203: v1(39.75,38.95) 39.75,38.66 43.61,34.8 43.61,12.71 41.66,10.76 v1(41.66,9.36)
DATA5_X: length 22.4
  Top Layer w0.203: v1(33.49,61.5) 33.53,61.54 FPC6.20 ; U22.51 33.29,41.5 33.09,41.7 v1(33.09,43.23)
  Bottom Layer w0.203: v1(33.09,43.23) 33.64,43.78 33.64,60.94 33.49,61.09 v1(33.49,61.5)
DATA6: length 37.1
  Top Layer w0.203: FPC7.18 40.76,10.75 40.76,9.47 41.51,8.72 42.04,8.72 v1(42.74,9.42) ; 40.79,40.52 40.79,39.2 v1(40.52,38.92)
  Bottom Layer w0.203: v1(42.74,9.42) 43.95,10.63 43.95,35.01 43.4,35.55 43.4,36.04 v1(40.52,38.92)
DATA6_X: length 22.5
  Top Layer w0.203: v1(33.7,42.76) 33.79,42.66 33.79,40.52 ; FPC6.18 34.61,62.47 34.61,60.72 v1(34.47,60.59)
  Bottom Layer w0.203: v1(33.7,42.76) 34.47,43.53 v1(34.47,60.59)
DATA7: length 33.3
  Top Layer w0.203: FPC7.16 39.66,12.62 v1(38.48,13.8) ; v1(38.14,37.27) 38.67,37.81 40.92,37.81 41.29,38.18 U22.35
  Bottom Layer w0.203: v1(38.48,13.8) 38.23,13.8 38.15,13.88 38.15,20.55 38.15,20.56 38.15,21.02 38.15,21.02 38.15,34.4 38.4,34.66 38.4,35.12 38.15,35.38 38.15,37.01 38.14,37.02 v1(38.14,37.27)
DATA7_X: length 22.6
  Top Layer w0.203: FPC6.16 35.53,60.76 v1(35.59,60.71) ; 34.79,40.52 34.79,42.36 v1(34.48,42.67)
  Bottom Layer w0.203: v1(35.59,60.71) 35.59,45.45 34.86,44.72 34.86,43.05 v1(34.48,42.67)
DATA8: length 36.3
  Top Layer w0.203: v1(38.71,36.61) 39.39,37.3 41.3,37.3 41.78,37.78 41.78,40.51 41.79,40.52 ; FPC7.14 v1(38.66,9.36)
  Bottom Layer w0.203: v1(38.71,36.61) 38.71,35.25 38.71,35.25 38.71,34.98 40.03,33.66 40.03,10.56 38.83,9.36 v1(38.66,9.36)
DATA8_X: length 22.7
  Top Layer w0.203: v1(35.42,43.43) 35.42,42.87 35.19,42.64 35.19,42.11 35.29,42.01 U22.47 ; FPC6.14 36.43,62.45 36.43,61.79 36.28,61.64 v1(36.28,61.21)
  Bottom Layer w0.203: v1(35.42,43.43) 36.28,44.29 36.28,60.36 36.23,60.41 36.23,60.88 36.28,60.93 v1(36.28,61.21)
DATA9: length 37.6
  Top Layer w0.203: FPC7.12 37.66,9.57 38.51,8.72 38.99,8.72 v1(39.62,9.36) ; U22.33 42.29,40.52 42.29,37.85 41.1,36.66 40,36.66 v1(39.37,36.04)
  Bottom Layer w0.203: v1(39.37,36.04) 40.34,35.07 40.34,10.07 v1(39.62,9.36)
DATA9_X: length 22.8
  Top Layer w0.203: v1(35.75,42.4) 35.79,42.36 35.79,40.52 ; FPC6.12 37.53,61.39 v1(36.78,60.65)
  Bottom Layer w0.203: v1(36.78,60.65) 36.78,44.24 36.13,43.59 36.13,42.79 v1(35.75,42.4)
DIN: length 17.7
  Top Layer w0.203: U19.28 26.82,19.65 27.98,18.49 v1(27.98,18.29) ; v1(16.36,13.73) 16.9,13.19 17.24,13.19 17.39,13.04 17.39,12.67 17.42,12.64 U23.1
  Bottom Layer w0.203: v1(27.98,18.29) 27.55,17.85 27.19,17.85 25.32,15.99 21.36,15.99 19.79,14.41 18.77,14.41 17.83,13.47 16.61,13.47 v1(16.36,13.73)
ESP_RESET: length 17.9
  Top Layer w0.203: U19.3 8.52,32.35 C16.1 4.7,36.16 SW1.2 SW1.1 6.75,44.18 R5.1
GATEA: length 41.9
  Top Layer w0.203: v1(11.43,29.3) 10.92,29.81 U19.5 ; v1(30.73,47.58) 32.51,47.58 32.77,47.84 32.77,48.98 32.49,49.25 32.04,49.25
  Bottom Layer w0.203: v1(11.43,29.3) 20.55,29.3 21.04,28.8 21.5,28.8 22,29.3 25.81,29.3 29.84,33.34 29.84,46.7 v1(30.73,47.58)
GATEB: length 52.3
  Top Layer w0.203: U19.6 7.19,28.54 v1(6.94,28.28) ; v1(32.51,23.2) 32.51,24.85 R51.2
  Bottom Layer w0.203: v1(32.51,23.2) 32.51,13.8 30.96,12.25 15.21,12.25 8.66,18.81 8.66,19.37 7.85,20.18 7.29,20.18 6.37,21.1 6.37,27.71 v1(6.94,28.28)
HSYNC: length 45.1
  Top Layer w0.203: v1(34.92,29.64) 35.33,30.04 38.4,30.04 38.86,30.49 39.86,30.49 40.95,31.58 42.52,31.58 43.29,32.36 U22.26 ; v1(24.88,20.04) 24.17,20.04 22.23,21.98 9.24,21.98 U19.11 ; U22.12 36.29,32.42 36.19,32.32 36.19,32.25 35.96,32.02 35.89,32.02 v1(35.69,31.82)
  Bottom Layer w0.203: v1(24.88,20.04) 25.24,20.04 34.84,29.64 v1(34.92,29.64) 35.69,30.4 v1(35.69,31.82)
HSYNC_X: length 23
  Top Layer w0.203: v1(37.78,60.62) 39.03,61.87 39.03,62.55 ; 36.79,40.52 36.79,43.21 v1(37.02,43.43)
  Bottom Layer w0.203: v1(37.78,60.62) 37.78,44.2 v1(37.02,43.43)
HSYNC_Y: length 42.1
  Top Layer w0.203: FPC7.9 v1(36.17,9.23) ; v1(43.42,38.17) 43.31,38.17 43.29,38.19 U22.31
  Bottom Layer w0.203: v1(43.42,38.17) 43.7,37.89 43.7,35.68 44.25,35.13 44.25,9.16 43.56,8.47 36.93,8.47 v1(36.17,9.23)
LRCLK: length 23.6
  Top Layer w0.203: v1(17.66,14.16) 18.82,13 18.82,11.15 18.67,11 18.39,11 U23.14 ; v1(28.07,19.77) 27.97,19.77 27.39,20.35 27.1,20.35 U19.29
  Bottom Layer w0.203: v1(28.07,19.77) 27.94,19.77 24.77,16.6 20.98,16.6 19.41,15.02 16.91,15.02 16.53,15.4 15.95,15.4 15.57,15.02 15.57,14.61 15.9,14.28 17.53,14.28 v1(17.66,14.16)
MIC_CLK: length 25.7
  Top Layer w0.203: U19.24 21.84,16.72 21.84,14.61 22.87,13.58 22.87,7.69 22.13,6.95 21.47,6.95 21.23,6.7 FPC3.3 21.23,5.38 20.46,4.62 10.9,4.62 10.18,5.34 FPC4.3
MIC_DIN: length 26.5
  Top Layer w0.203: v1(15.37,5.17) 11.51,5.17 11.43,5.09 10.92,5.09 10.68,5.34 FPC4.4 ; 21.73,5.05 21.74,5.04 22.38,5.04 23.49,6.15 U19.25 ; 21.73,5.05 FPC3.4 ; 21.73,5.05 v1(21.21,4.53)
  Bottom Layer w0.203: v1(21.21,4.53) 16.01,4.53 v1(15.37,5.17)
OEA: length 9.1
  Top Layer w0.203: U19.39 27.18,33.62 30.79,37.23 30.79,40.52
OEB: length 10.4
  Top Layer w0.203: U19.38 26.9,32.35 31.29,36.74 U22.55
OUTN: length 8.9
  Top Layer w0.203: U23.10 16.51,8.98 v1(16.38,8.85) ; v1(14.35,8.85) 13.05,8.85 L4.1
  Bottom Layer w0.203: v1(14.35,8.85) v1(16.38,8.85)
OUTP: length 7.2
  Top Layer w0.203: U23.9 14.52,8.14 11.4,8.14 11.27,8.01 10.27,8.01 9.75,8.53 L3.1
PCLK: length 47.7
  Top Layer w0.203: v1(13.08,27.06) 10.75,24.73 U19.9 ; 42.79,33.12 42.79,33.89 41.33,35.35 39.04,35.35 36.36,38.03 v1(36.2,38.03) ; v1(36.58,34.68) 36.58,34.67 35.79,33.89 35.79,33.12
  Bottom Layer w0.203: v1(13.08,27.06) 21.08,27.06 22.99,28.97 25.91,28.97 31.65,34.71 31.65,35.62 34.06,38.03 v1(36.2,38.03) 36.13,37.97 36.13,35.5 36.46,35.17 36.46,34.8 v1(36.58,34.68)
PCLK_X: length 30.5
  Top Layer w0.203: U22.45 36.32,40.55 36.32,43.65 35.43,44.54 30.48,44.54 29.53,45.49 v1(29.53,53.3) ; v1(30.86,55.59) 31.75,56.47 31.75,57.74 32.46,58.45 C102.2 33.32,58.45 35.03,60.17 35.03,62.55
  Bottom Layer w0.203: v1(29.53,53.3) 30.86,54.63 v1(30.86,55.59)
PCLK_Y: length 35.4
  Top Layer w0.203: FPC7.17 40.13,10.88 40.13,13.93 42.1,15.9 C104.2 42.1,17.61 42.3,17.8 42.36,17.8 42.63,18.07 42.63,18.33 42.92,18.62 42.92,19.27 42.23,19.96 42.23,20.53 42.43,20.73 44.77,20.73 45.77,21.73 45.77,26.4 45.9,26.52 45.9,26.99 45.77,27.11 45.77,34.96 43.12,37.61 43.06,37.61 42.79,37.88 42.79,40.52
PWDN: length 9
  Top Layer w0.203: FPC7.8 35.57,10.94 35.57,11.6 35.54,11.62 35.54,12.64 35.69,12.79 35.71,12.79 R42.2
PWDN_X: length 7.5
  Top Layer w0.203: R38.2 35.7,59.81 37.89,59.81 39.53,61.44 FPC6.8
SC0: length 51.5
  Top Layer w0.203: 10.85,47.26 12.76,47.26 v1(12.83,47.33) ; v1(27.18,56.09) 27.18,55.46 24.64,52.92 19.81,52.92 v1(18.03,51.14) ; v1(27.18,58) 27.18,63.71 28.58,65.11 28.58,66.1 29.23,66.76 38.05,66.76 40.93,63.87 40.93,62.65 41.03,62.55 41.03,59.65 40.57,59.2 39.79,59.2 R35.2
  Bottom Layer w0.203: v1(12.83,47.33) 14.22,47.33 v1(18.03,51.14) ; v1(27.18,58) v1(27.18,56.09)
SC1: length 76.4
  Top Layer w0.203: v1(12.83,45.68) 11.78,45.68 11.72,45.73 11.08,45.73 10.85,45.96 ; v1(35.18,16.72) 35.18,16.76 R39.2 35.88,16.28 34.17,14.57 FPC7.5
  Bottom Layer w0.203: v1(12.83,45.68) 12.06,44.92 12.06,44.74 11.86,44.54 8.64,44.54 6.06,41.96 6.06,20.98 7.16,19.87 7.72,19.87 8.36,19.24 8.36,18.68 15.09,11.95 32.82,11.95 35.18,14.31 v1(35.18,16.72)
SCL: length 88
  Top Layer w0.203: v1(7.44,25.64) 5.01,25.64 JP1.4 2.62,26.58 2.29,26.25 v1(2.29,23.71) ; U24.23 3.24,19.2 2.29,20.15 v1(2.29,20.66) ; v1(21.27,29.36) 22.48,28.15 v1(22.48,27.01) 26.27,27.01 U19.34 ; R49.1 25.15,49.24 25.4,48.98 25.4,48.37 v1(25.45,48.32) ; v1(17.78,44.16) 18.13,44.5 18.13,48.13 17.69,48.56 U18.14
  Bottom Layer w0.203: v1(22.48,27.01) 21.11,25.64 v1(7.44,25.64) ; v1(25.45,48.32) 25.32,48.32 24.21,47.2 17.78,47.2 v1(17.78,44.16) 16.76,43.14 8.76,43.14 8,42.38 8,36.15 8.76,35.39 15.24,35.39 v1(21.27,29.36) ; v1(2.29,20.66) v1(2.29,23.71)
SD0: length 51
  Top Layer w0.203: v1(12.83,48.22) 12.45,47.84 10.92,47.84 10.85,47.91 ; v1(26.29,56.09) 23.42,53.22 19.33,53.22 17.24,51.14 v1(17.14,51.14) ; R36.2 42.03,59.84 42.03,60.23 42.15,60.35 42.15,60.81 42.03,60.93 42.03,62.55 41.93,62.65 41.93,63.3 38.17,67.07 29.11,67.07 28.27,66.23 28.27,65.24 26.87,63.84 26.87,58.71 v1(26.16,58)
  Bottom Layer w0.203: v1(26.29,56.09) 26.16,56.22 v1(26.16,58) ; v1(17.14,51.14) 14.22,48.22 v1(12.83,48.22)
SD1: length 70.6
  Top Layer w0.203: v1(33.3,9.76) 33.3,10.05 33.26,10.09 33.26,10.75 FPC7.3 33.17,16.27 R40.2 ; v1(9.53,45.43) 9.53,45.51 9.64,45.62 9.64,46.26 9.89,46.51 10.53,46.51 10.63,46.61 10.85,46.61
  Bottom Layer w0.203: v1(9.53,45.43) 8,45.43 5.75,43.18 5.75,20.85 7.04,19.57 7.11,19.57 7.24,19.44 7.72,19.44 8.05,19.11 8.05,18.2 14.61,11.64 29.84,11.64 32.26,9.23 32.77,9.23 v1(33.3,9.76)
SD_MODE: length 4.6
  Top Layer w0.203: R47.1 15.55,15.22 15.7,15.07 15.7,14.61 15.8,14.51 15.8,13.5 16.01,13.28 U23.4
SDA: length 89.3
  Top Layer w0.203: U19.35 25.02,28.54 v1(24.13,27.65) 24.13,27.77 v1(21.34,30.57) ; R48.1 v1(26.42,48.85) ; JP1.3 6.57,24.58 v1(7.44,23.71) ; v1(18.69,44.79) 18.69,48.46 17.93,49.21 U18.15 ; v1(1.4,21.42) 1.4,20.53 2.84,19.09 U24.24
  Bottom Layer w0.203: v1(7.44,23.71) 20.19,23.71 v1(24.13,27.65) ; v1(1.4,21.42) 0.75,22.07 0.75,23.83 1.51,24.58 JP1.3 ; v1(26.42,48.85) 26.42,48.5 24.74,46.82 19.45,46.82 19.3,46.68 19.3,45.41 v1(18.69,44.79) 18.69,44.27 17.25,42.83 8.89,42.83 8.31,42.25 8.31,36.28 8.89,35.7 16.2,35.7 v1(21.34,30.57)
SELECT1: length 27.2
  Top Layer w0.203: v1(19.68,10.63) 20.32,11.26 R45.1 ; U19.26 24.77,13.86 23.95,13.04 23.95,12.58 24.77,11.77 24.77,7.02 23.8,6.06 23.8,6.02 22.51,4.73 22.48,4.73 v1(22.23,4.48) ; v1(21.21,7.58) 20.73,7.1 FPC3.2 20.73,5.38 20.48,5.14 19.97,5.14 19.82,5.29 v1(19.18,5.29)
  Bottom Layer w0.203: v1(19.68,10.63) 19.68,9.1 v1(21.21,7.58) ; v1(19.18,5.29) 19.43,5.29 19.63,5.09 21.44,5.09 21.77,4.76 21.77,4.3 21.95,4.48 v1(22.23,4.48)
STROBE: length 78.9
  Top Layer w0.203: TP7.P$1 30.68,12.33 FPC7.1 32.17,9.96 35.48,6.64 41.1,6.64 46.99,12.53 46.99,55.44 TP6.P$1 44.33,61.25 43.03,62.55
VO+: length 9
  Top Layer w0.203: 10.77,8.53 10.77,9.86 C107.2 10.63,9.94 10.11,9.41 9.11,9.41 8.58,9.94 4.31,9.94 X7.2
VO-: length 9
  Top Layer w0.203: X7.1 9.69,12.94 10.63,13.87 C106.2 10.77,13.8 10.77,12.22
VSYNC: length 47.7
  Top Layer w0.203: U19.10 10.66,23.46 v1(11.3,22.82) ; 43.79,33.12 43.79,32.36 42.71,31.28 41.08,31.28 39.99,30.19 38.99,30.19 38.44,29.64 35.98,29.64 v1(35.81,29.47) ; v1(12.57,20.86) 22.12,20.86 v1(23.43,19.55) ; v1(36.6,31.88) 36.6,32.17 36.79,32.36 36.79,33.12
  Bottom Layer w0.203: v1(36.6,31.88) 36.6,30.26 v1(35.81,29.47) 35.69,29.47 25.48,19.26 23.72,19.26 v1(23.43,19.55) ; v1(11.3,22.82) 11.38,22.74 11.38,21.19 11.71,20.86 v1(12.57,20.86)
VSYNC_X: length 23.2
  Top Layer w0.203: U22.43 37.29,41.7 37.65,42.06 v1(37.65,42.93) ; 40.03,62.55 39.93,62.45 39.93,61.06 v1(38.98,60.1)
  Bottom Layer w0.203: v1(38.98,60.1) 38.98,44.25 v1(37.65,42.93)
VSYNC_Y: length 43.6
  Top Layer w0.203: FPC7.7 v1(35.17,9.23) ; 43.79,40.52 43.79,38.59 v1(44.2,38.19)
  Bottom Layer w0.203: v1(44.2,38.19) 44.2,35.62 44.56,35.26 44.56,9.03 43.69,8.16 36.8,8.16 36.29,8.67 35.93,8.67 35.37,9.23 v1(35.17,9.23)
XCLK: length 116.1
  Top Layer w0.203: v1(35.94,64.48) 35.94,64.4 36.93,63.41 36.93,62.65 37.03,62.55 ; v1(38.48,12.41) 38.48,12.02 38.1,11.64 38.1,10.91 FPC7.13 ; v1(24.51,12.81) 29.21,8.11 29.21,7.29 29.36,7.14 31.57,7.14 31.92,7.49 v1(31.92,7.71) ; v1(27.18,53.43) 27.18,44.92 25.91,43.65 22.26,43.65 21.39,44.52 21.39,44.87 20.83,45.43 18.16,42.76 10.8,42.76 8.89,40.85 8.89,36.59 10.97,34.51 10.97,32.73 9.89,31.65 9.6,31.65 U19.4 9.02,31.07 v1(7.62,31.07)
  Bottom Layer w0.203: v1(38.48,12.41) 38.25,12.41 37.7,11.85 36.3,11.85 33.38,8.93 32.51,8.93 32.49,8.9 32.28,8.9 31.95,8.57 31.95,8.11 31.92,8.08 v1(31.92,7.71) ; v1(35.94,64.48) 33.78,64.48 33.75,64.44 31.31,64.44 27.64,60.77 27.64,60.31 27.74,60.21 27.74,55.86 27.18,55.3 v1(27.18,53.43) ; v1(24.51,12.81) 15.19,12.81 9.09,18.9 9.09,19.37 7.98,20.48 7.52,20.48 6.67,21.33 6.67,27.25 7.14,27.72 7.17,27.72 7.62,28.18 v1(7.62,31.07)
~RESET_X~: length 64.4
  Top Layer w0.203: v1(28.19,60.54) 27.81,60.92 27.81,61.02 31.08,64.29 31.08,65.46 31.95,66.33 38.03,66.33 39.99,64.37 39.99,64.13 40.15,63.97 40.15,63.59 40.43,63.3 40.43,62.65 FPC6.6 40.63,62.45 40.63,60 40.13,59.5 39.18,59.5 38.15,58.47 37.53,58.47 37.43,58.37 35.96,58.37 ; U19.31 27.1,24.03 27.39,24.03 28.07,24.71 v1(28.07,32.73) ; v1(28.07,54.44) v1(28.07,35.77)
  Bottom Layer w0.203: v1(28.07,35.77) v1(28.07,32.73) ; v1(28.19,60.54) 28.19,54.57 v1(28.07,54.44)
~RESET~: length 35.9
  Top Layer w0.203: v1(34.4,8.98) 34.61,9.18 34.61,9.93 34.66,9.99 FPC7.6 34.66,14.05 37.53,16.92 R41.2 39.04,17.47 C105.1 ; U19.33 25.96,25.43 25.67,25.43 25.53,25.28 25.53,13.04 29.32,9.25 31.57,9.25 32.48,8.34 v1(32.51,8.34)
  Bottom Layer w0.203: v1(32.51,8.34) 33.77,8.34 v1(34.4,8.98)
$2N4099: length 8.2
  Top Layer w0.203: 10.85,49.21 10.85,49.89 C139.2 13.37,50.63 v1(13.59,50.63) ; v1(15.62,52.41) 15.91,52.12 C111.2
  Bottom Layer w0.203: v1(15.62,52.41) 15.37,52.41 v1(13.59,50.63)
$2N4102: length 3.2
  Top Layer w0.203: R44.2 8.43,49.69 9.52,48.6 10.81,48.6 10.85,48.56
$2N4133: length 2.8
  Top Layer w0.203: R52.1 30.85,49.24 30.53,49.55 Q5.1
$2N4138: length 5.6
  Top Layer w0.203: R51.1 30.79,24.87 29.99,24.87 29.84,24.72 29.84,22.43 29.59,22.17 29.59,21.71 29.84,21.45 29.84,21.12 29.97,21.12 Q6.1
$2N9597: length 6
  Top Layer w0.203: X9.3 23.62,49.94 23.62,49.85 24.89,48.58 24.89,47.08 23.62,45.81 SJ13.3
$2N23062: length 2.9
  Top Layer w0.203: U2.3 4.62,47.55 R1.2
$2N26134: length 6.8
  Top Layer w0.203: R12.1 11.79,64.57 USBC1.A5
$2N26142: length 6.3
  Top Layer w0.203: R11.2 8.79,63.58 USBC1.B5
$2N28904: length 2.5
  Top Layer w0.203: LED1.2 R4.1
$2N44705: length 4.2
  Top Layer w0.203: R50.1 5.99,14.8 3.78,14.8 3.64,14.95 U24.9

## Copper pours and planes (outline as drawn; the poured copper is in the pictures)
GND on Top Layer: -3.68,77.18 51.94,77.18 51.94,-9.06 -3.68,-9.06
GND on Bottom Layer: -4.19,79.46 51.94,79.46 51.94,-5.76 -4.19,-5.76

## Text on the board
Top Silkscreen Layer: RESET | BOOT | SDA | GND | VIN | SCL
